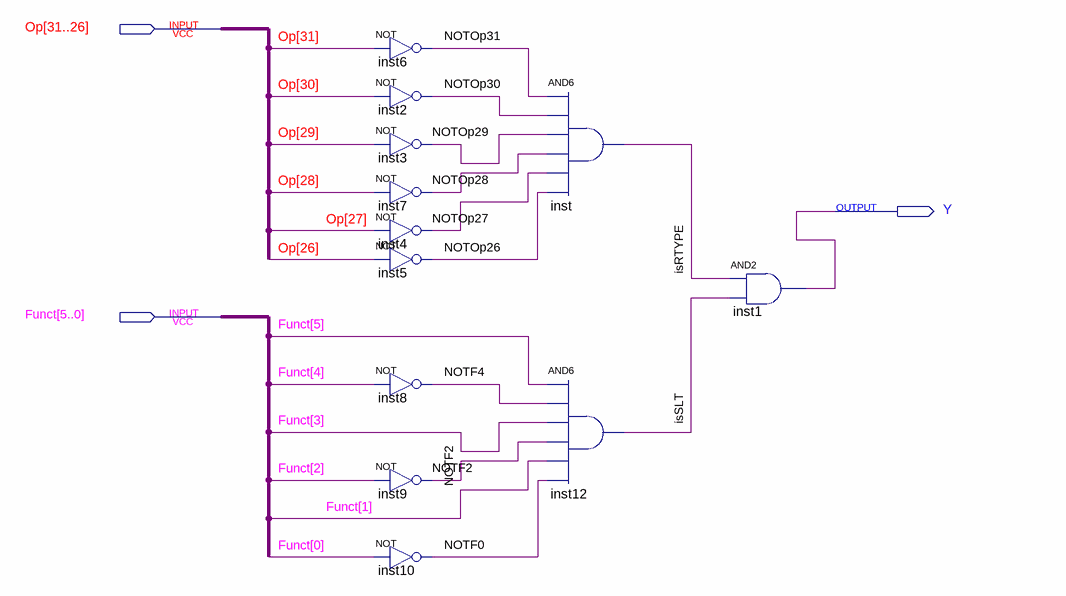
[diagram p0: schematic sheet]
// Quartus schematic SLT.bdf as structural Verilog: 12 symbols, 3 pins
module SLT (
  input  [31:26] Op,
  input  [5:0] Funct,
  output Y
);

  wire isRTYPE, isSLT, NOTF0, NOTF2, NOTF4, NOTOp26, NOTOp27, NOTOp28, NOTOp29, NOTOp30, NOTOp31;

  not inst6 (NOTOp31, Op[31]);
  not inst2 (NOTOp30, Op[30]);
  not inst3 (NOTOp29, Op[29]);
  not inst7 (NOTOp28, Op[28]);
  not inst4 (NOTOp27, Op[27]);
  not inst5 (NOTOp26, Op[26]);
  not inst8 (NOTF4, Funct[4]);
  not inst9 (NOTF2, Funct[2]);
  not inst10 (NOTF0, Funct[0]);
  and inst (isRTYPE, NOTOp31, NOTOp30, NOTOp29, NOTOp28, NOTOp27, NOTOp26);
  and inst12 (isSLT, Funct[5], NOTF4, Funct[3], NOTF2, Funct[1], NOTF0);
  and inst1 (Y, isRTYPE, isSLT);
endmodule
